# EAGLE design LB_BIT_o1_LED-v02(rev1) (EAGLE 6.1)
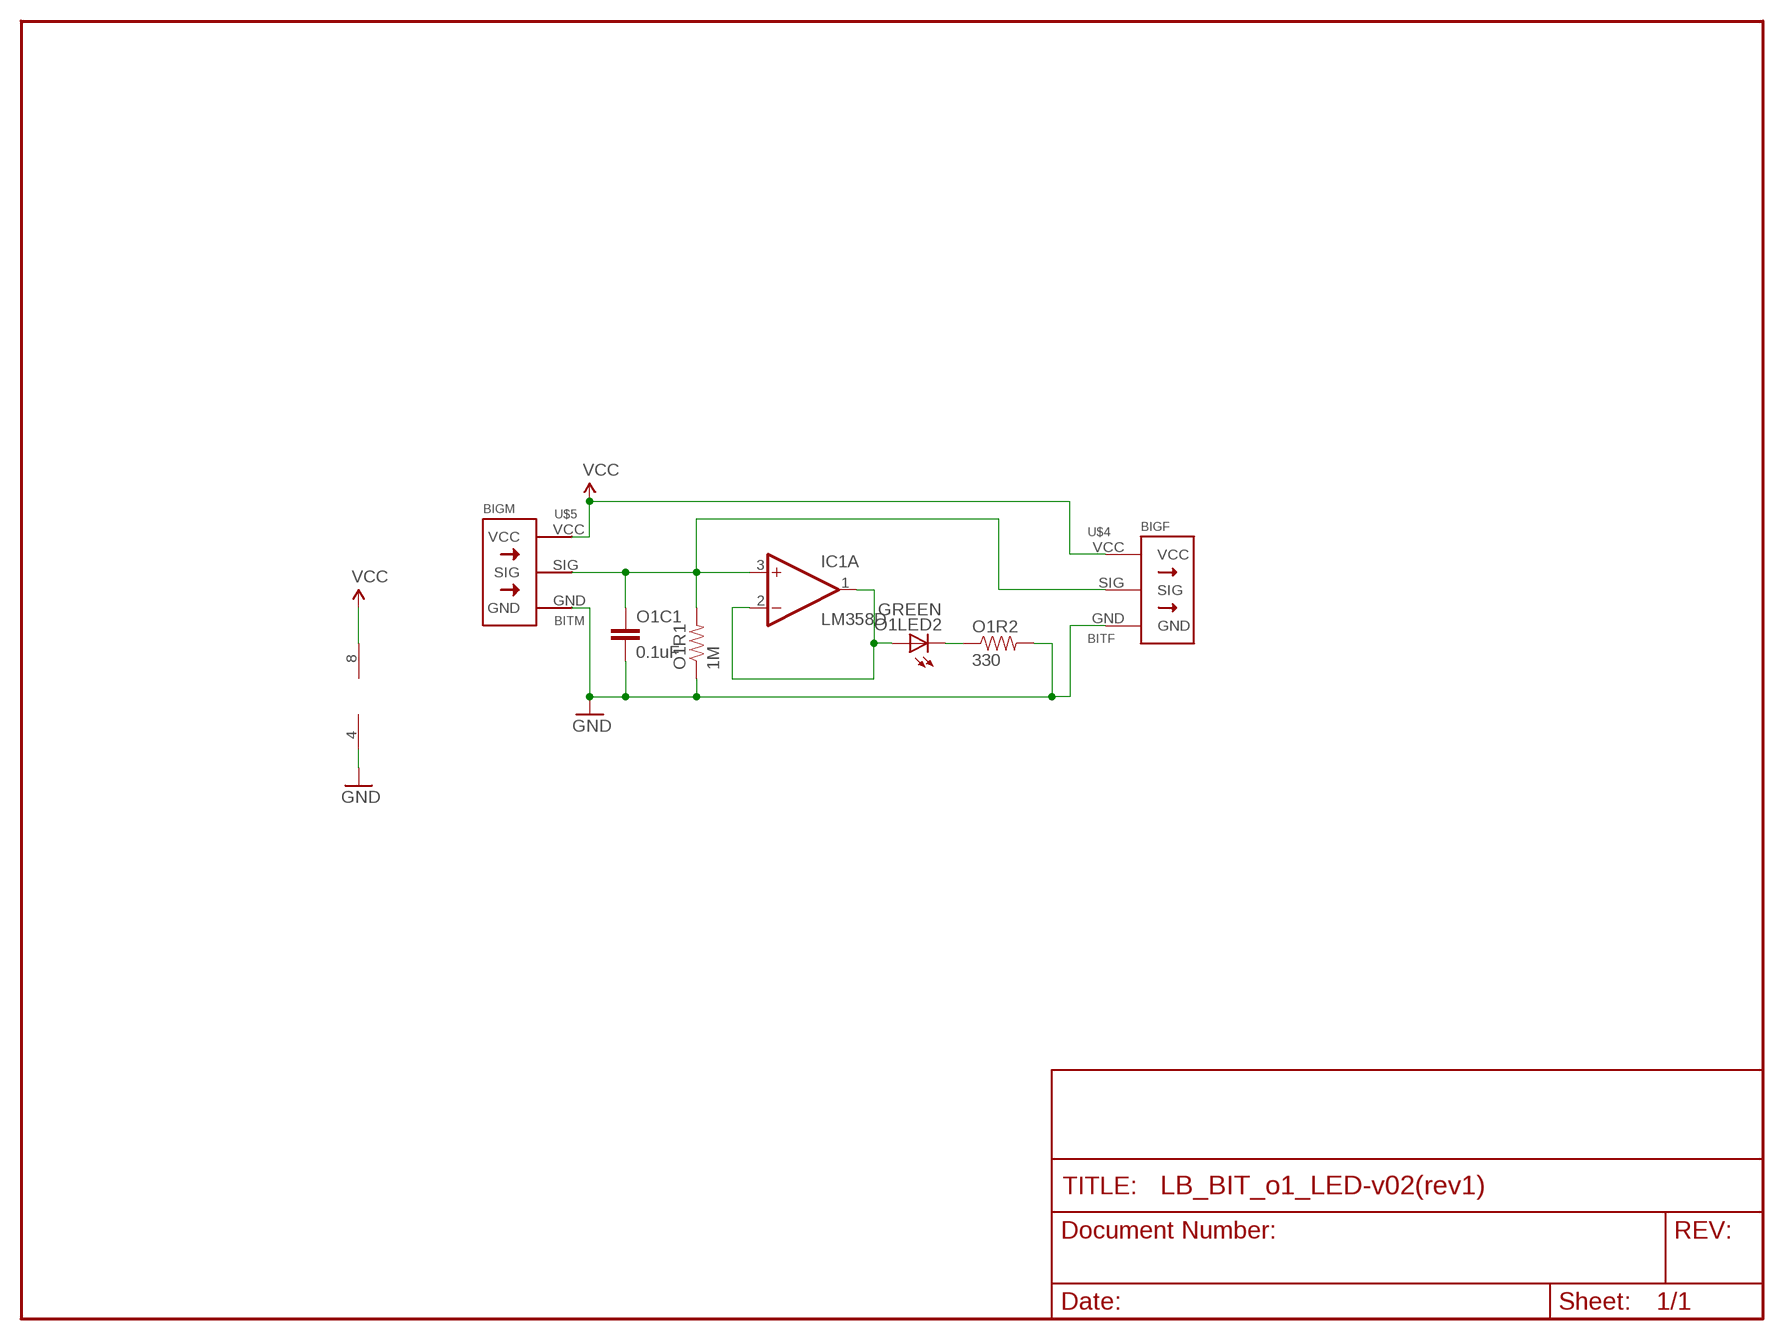
[diagram p0: schematic, sheet 1]

## Parts
IC1  LM358D  [SO08]
O1C1  0.1uF  CAP1206  [1206]
O1LED2  GREEN  LED10MM  [LED10MM]
O1R1  1M  RESISTOR  [0805]
O1R2  330  RESISTOR  [0805]
U$4  BITF  [BITM]
U$5  BITM  [BITM]

## Nets
GND: IC1.4(P:V-) O1C1.2 O1R1.1 O1R2.2 U$4.GND U$5.GND
LEDGND: O1LED2.C O1R2.1
N$1: IC1.1(A:OUT) IC1.2(A:-IN) O1LED2.A
SIG: IC1.3(A:+IN) O1C1.1 O1R1.2 U$4.SIG U$5.SIG
VCC: IC1.8(P:V+) U$4.VCC U$5.VCC
Unconnected: IC1.5(B:+IN) IC1.6(B:-IN) IC1.7(B:OUT)

## Library data of the parts
IC1 = linear:LM358: OP AMP also LM158; LM258; LM2904 Source: http://cache.national.com/ds/LM/LM158.pdf
O1C1 = SparkFun:CAP: Capacitor Standard 0603 ceramic capacitor, and 0.1" leaded capacitor.
O1LED2 = SparkFun:LED: LEDs Standard schematic elements and footprints for 5mm, 3mm, 1206, and 0603 sized LEDs. 5mm - Spark Fun Electronics SKU : COM-00529 (and others)
O1R1 O1R2 = SparkFun:RESISTOR: Resistor Basic schematic elements and footprints for 0603, 1206, and PTH 1/10th watt (small) resistors.
U$4 = radames:BITF
U$5 = radames:BITM

## Board
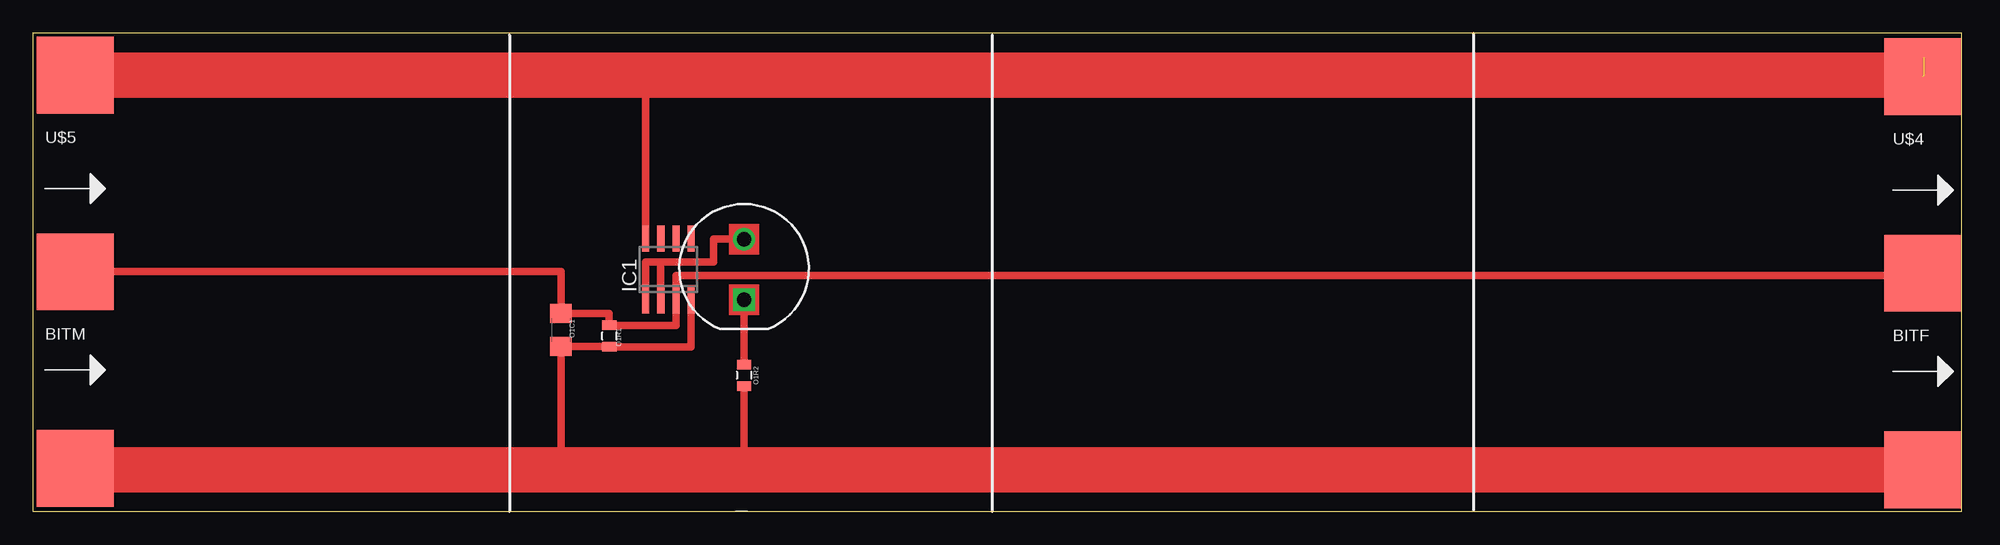
[diagram p1: board, top side]

Size 161.91 x 40.16 mm. Coordinates in mm from the lower left corner, seen from the top.
Outline: 0,0 161.91,0 161.91,40.16 0,40.16 0,0
Copper layers (1*16): Top 0.035mm / dielectric 1.5mm / Bottom 0.035mm
Design rules: minimum track width 8mil, minimum drill 20mil, track to track 8mil, track to pad 8mil, pad to pad 8mil, via to via 8mil, smd to smd 8mil, copper to edge 8mil, drill to drill 8mil, minimum pad ring 12mil, minimum via ring 10mil, stop-mask expansion 4mil, vias tented up to drill 20mil, thermal gap 10mil

### Footprints (pad centres in the part's own frame; a part is rotated, then mirrored left to right if it is on the bottom)
SO08 = smd 0.6 x 2.2: 1 -1.905,-2.6; 2 -0.635,-2.6; 3 0.635,-2.6; 4 1.905,-2.6; 5 1.905,2.6; 6 0.635,2.6; 7 -0.635,2.6; 8 -1.905,2.6
1206 = smd 1.6 x 1.8: 1 -1.4,0; 2 1.4,0
LED10MM = drill 1.2 pad 1.88: A 2.54,0 | drill 1.2 pad 1.88 square: C -2.54,0
0805 = smd 0.8 x 1.2: 1 -0.9,0; 2 0.9,0
BITM = smd 6.452 x 6.452: GND 3.175,-16.192; SIG 3.175,0.318; VCC 3.175,16.828

### Placement (x,y rotation side)
IC1  53.34,20.32 0 top
O1C1  44.32,15.24 270 top
O1LED2  59.69,20.32 90 top
O1R1  48.39,14.73 90 top
O1R2  59.69,11.43 270 top
U$4  155.45,19.69 0 top
U$5  0.38,19.81 0 top

### Tracks (layer width: path | path; a pad name or v marks a point on that pad's centre or on a via)
GND
  Top 0.61: O1R2.2 59.69,3.49 | 44.07,3.87 44.45,3.49 44.32,3.49 O1C1.2 O1R1.1 55.25,13.83 IC1.4
  Top 3.81: U$4.GND 59.69,3.49 44.45,3.49 3.56,3.49 U$5.GND
LEDGND
  Top 0.61: O1LED2.C O1R2.1
N$1
  Top 0.61: IC1.1 51.44,20.95 52.7,20.95 | IC1.2 52.7,20.95 | 52.7,20.95 57.15,20.95 57.15,22.86 O1LED2.A
SIG
  Top 0.61: 158.62,20.13 U$4.SIG arc-90 158.43,19.81 53.97,19.81 IC1.3 53.97,15.63 O1R1.2 48.39,16.64 O1C1.1 44.32,20.13 U$5.SIG
VCC  (2 unrouted)
  Top 0.61: 57.15,35.56 57.15,36.64 | IC1.8 51.44,36 50.8,36.64
  Top 3.81: U$5.VCC 50.8,36.64 57.15,36.64 158.75,36.64
(copper drawn outside any net)
  shapes: Top area x2